# Altium schematic sheet Sheet1.SchDoc
size A
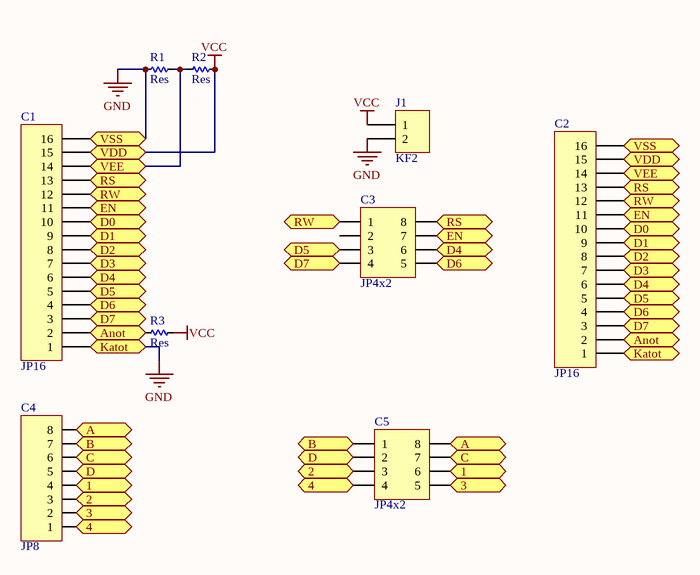
[diagram p0: Sheet1.SchDoc]

## Parts
C1  JP16  [JP16-D1T]
C2  JP16  [JP16-D1T]
C3  JP4x2  [JP4-D2T]
C4  JP8  [JP8-D1C]
C5  JP4x2  [JP4-D2T]
J1  KF2  [KF2-3.5]
R1  Res  [RES-1/4W]
R2  Res  [RES-1/4W]
R3  Res  [RES-1/4W]

## Ports
1, 2, 3, 4, A, Anot, B, C, D, D0, D1, D2, D3, D4, D5, D6, D7, EN, Katot, RS, RW, VDD, VEE, VSS

## Nets
GND: C1.1 C1.16 C2.1 C2.16 J1.2 R1.2 ; port VSS, port Katot
VCC: C1.15 C2.15 J1.1 R2.1 R3.1 ; port VDD
1: C4.4 C5.6 ; port 1
2: C4.3 C5.3 ; port 2
3: C4.2 C5.5 ; port 3
4: C4.1 C5.4 ; port 4
A: C4.8 C5.8 ; port A
Anot: C1.2 C2.2 R3.2 ; port Anot
B: C4.7 C5.1 ; port B
C: C4.6 C5.7 ; port C
D: C4.5 C5.2 ; port D
D0: C1.10 C2.10 ; port D0
D1: C1.9 C2.9 ; port D1
D2: C1.8 C2.8 ; port D2
D3: C1.7 C2.7 ; port D3
D4: C1.6 C2.6 C3.6 ; port D4
D5: C1.5 C2.5 C3.3 ; port D5
D6: C1.4 C2.4 C3.5 ; port D6
D7: C1.3 C2.3 C3.4 ; port D7
EN: C1.11 C2.11 C3.7 ; port EN
RS: C1.13 C2.13 C3.8 ; port RS
RW: C1.12 C2.12 C3.1 ; port RW
VEE: C1.14 C2.14 R1.1 R2.2 ; port VEE

Not connected (* = marked no-connect by the designer): C3 2

## Library data of the parts
C1 C2 = JP16: WR-PHD 2.54 mm Angled Socket Header; Manufacturer: W¨¹rth Elektronik eiSos GmbH; partNo: 613016143121; ComponentLink1 Description: Manufacturer; ComponentLink2 Description: Datasheet; NoPins: 16; Created Date: 29 March 2013; ComponentLink1URL: http://www.we-online.com; ComponentLink2URL: http://katalog.we-online.de/em/datasheet/6130xx143121.pdf; Created by: Karrer Zheng
C3 C5 = JP4x2: WR-PHD 2.54 mm Dual Socket Header; Manufacturer: W¨¹rth Elektronik eiSos GmbH; partNo: 61300821821; ComponentLink1 Description: Manufacturer; ComponentLink2 Description: Datasheet; NoPins: 08; Created Date: 29 March 2013; ComponentLink1URL: http://www.we-online.com; ComponentLink2URL: http://katalog.we-online.de/em/datasheet/6130xx21821.pdf; Created by: Karrer Zheng
C4 = JP8: WR-PHD 2.54 mm Angled Socket Header; Manufacturer: W¨¹rth Elektronik eiSos GmbH; partNo: 613008143121; ComponentLink1 Description: Manufacturer; ComponentLink2 Description: Datasheet; NoPins: 08; Created Date: 29 March 2013; ComponentLink1URL: http://www.we-online.com; ComponentLink2URL: http://katalog.we-online.de/em/datasheet/6130xx143121.pdf; Created by: Karrer Zheng
J1 = KF2: Manufacturer: Würth Elektronik eiSos GmbH; partNo: 691103110002; ComponentLink1 Description: Manufacturer; ComponentLink2 Description: Datasheet; NoPins: 2; Created Date: 29 October 2013; ComponentLink1URL: http://www.we-online.com; ComponentLink2URL: http://katalog.we-online.de/em/datasheet/6911031100xx.pdf; Created by: Karrer Zheng
R1-R3 = Res: Manufacturer: Generic Components; Class: Passive; SubClass: R; Published: 08/06/2000; Publisher: Altium Hobart Technology Centre